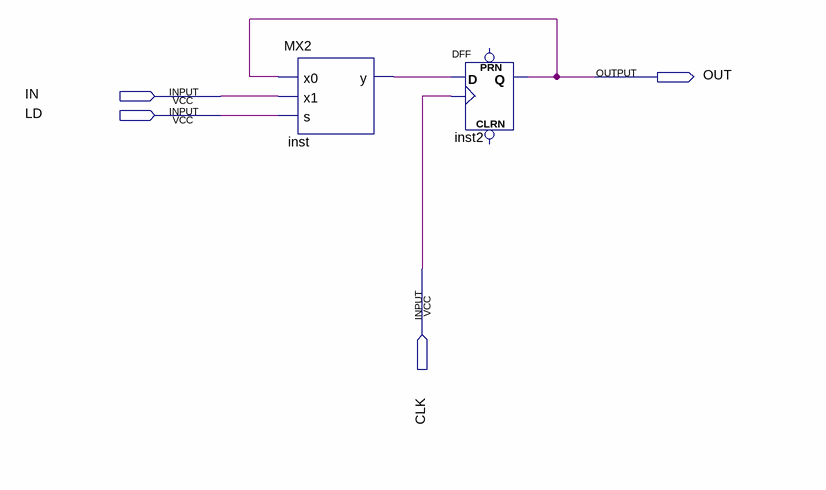
[diagram p0: schematic sheet]
// Quartus schematic REG1.bdf as structural Verilog: 2 symbols, 4 pins
module REG1 (
  input  IN,
  input  LD,
  input  CLK,
  output OUT
);

  wire inst_y;

  MX2 inst (.x0(OUT), .x1(IN), .s(LD), .y(inst_y));
  DFF inst2 (.CLK(CLK), .D(inst_y), .Q(OUT));  // open: CLRN, PRN
endmodule
